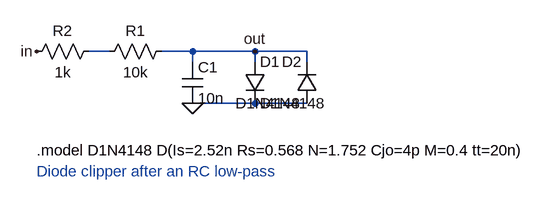
[diagram p0: schematic clipper-ltspice.asc]
clipper-ltspice.asc, the LTspice schematic file:
Version 4
SHEET 1 880 680
WIRE 112 96 80 96
WIRE 240 96 192 96
WIRE 336 96 240 96
WIRE 416 96 336 96
WIRE 240 112 240 96
WIRE 336 112 336 96
WIRE 416 112 416 96
WIRE 416 176 240 176
FLAG 0 96 in
FLAG 336 96 out
FLAG 240 176 0
SYMBOL res 208 80 R90
WINDOW 0 0 56 VBottom 2
WINDOW 3 32 56 VTop 2
SYMATTR InstName R1
SYMATTR Value 10k
SYMBOL res 96 80 R90
WINDOW 0 0 56 VBottom 2
WINDOW 3 32 56 VTop 2
SYMATTR InstName R2
SYMATTR Value 1k
SYMBOL cap 224 112 R0
SYMATTR InstName C1
SYMATTR Value 10n
SYMBOL diode 320 112 R0
SYMATTR InstName D1
SYMATTR Value D1N4148
SYMBOL diode 432 176 R180
WINDOW 0 24 64 Left 2
WINDOW 3 24 0 Left 2
SYMATTR InstName D2
SYMATTR Value D1N4148
TEXT 0 248 Left 2 !.model D1N4148 D(Is=2.52n Rs=0.568 N=1.752 Cjo=4p M=0.4 tt=20n)
TEXT 0 280 Left 2 ;Diode clipper after an RC low-pass

The netlist it stands for:
* clipper-ltspice.asc
R1 out N001 10k
R2 N001 in 1k
C1 out 0 10n
D1 out 0 D1N4148
D2 0 out D1N4148
.model D D
.lib standard.dio
.model D1N4148 D(Is=2.52n Rs=0.568 N=1.752 Cjo=4p M=0.4 tt=20n)
* Diode clipper after an RC low-pass
.backanno
.end